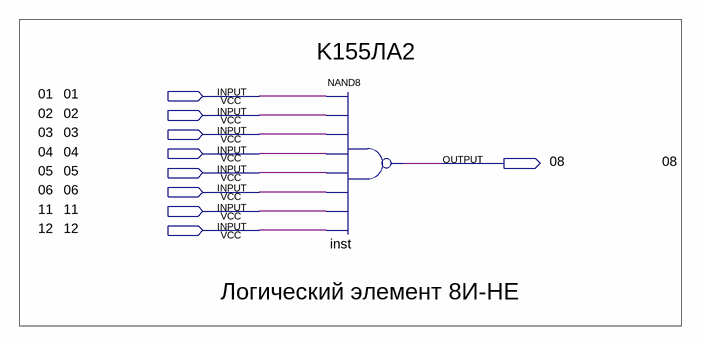
[diagram p0: schematic sheet]
// Quartus schematic K155LA2.bdf as structural Verilog: 1 symbols, 9 pins
module K155LA2 (
  input  \01 ,
  input  \02 ,
  input  \03 ,
  input  \04 ,
  input  \05 ,
  input  \06 ,
  input  \11 ,
  input  \12 ,
  output \08 
);

  nand inst (\08 , \01 , \02 , \03 , \04 , \05 , \06 , \11 , \12 );

  // Notes on the sheet:
  //   K155ЛА2
  //   01
  //   02
  //   03
  //   04
  //   08
  //   05
  //   06
  //   11
  //   12
  //   Логический элемент 8И-НЕ
endmodule
